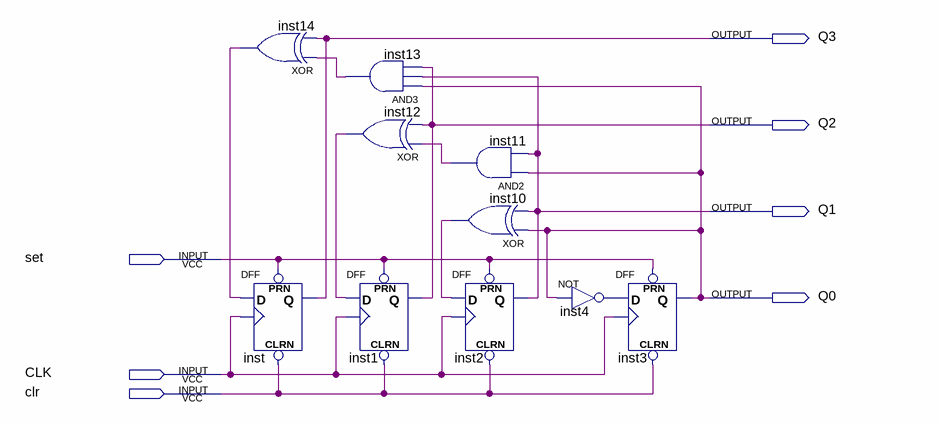
[diagram p0: schematic sheet]
// Quartus schematic test0508.bdf as structural Verilog: 10 symbols, 7 pins
module test0508 (
  input  set,
  input  CLK,
  input  clr,
  output Q3,
  output Q2,
  output Q1,
  output Q0
);

  wire inst4_out, inst10_out, inst11_out, inst12_out, inst13_out, inst14_out;

  xor inst14 (inst14_out, inst13_out, Q3);
  DFF inst (.CLRN(clr), .CLK(CLK), .D(inst14_out), .PRN(set), .Q(Q3));
  and inst13 (inst13_out, Q0, Q1, Q2);
  xor inst12 (inst12_out, inst11_out, Q2);
  DFF inst1 (.CLRN(clr), .CLK(CLK), .D(inst12_out), .PRN(set), .Q(Q2));
  and inst11 (inst11_out, Q0, Q1);
  xor inst10 (inst10_out, Q0, Q1);
  DFF inst2 (.CLRN(clr), .CLK(CLK), .D(inst10_out), .PRN(set), .Q(Q1));
  not inst4 (inst4_out, Q0);
  DFF inst3 (.CLRN(clr), .CLK(CLK), .D(inst4_out), .PRN(set), .Q(Q0));
endmodule
